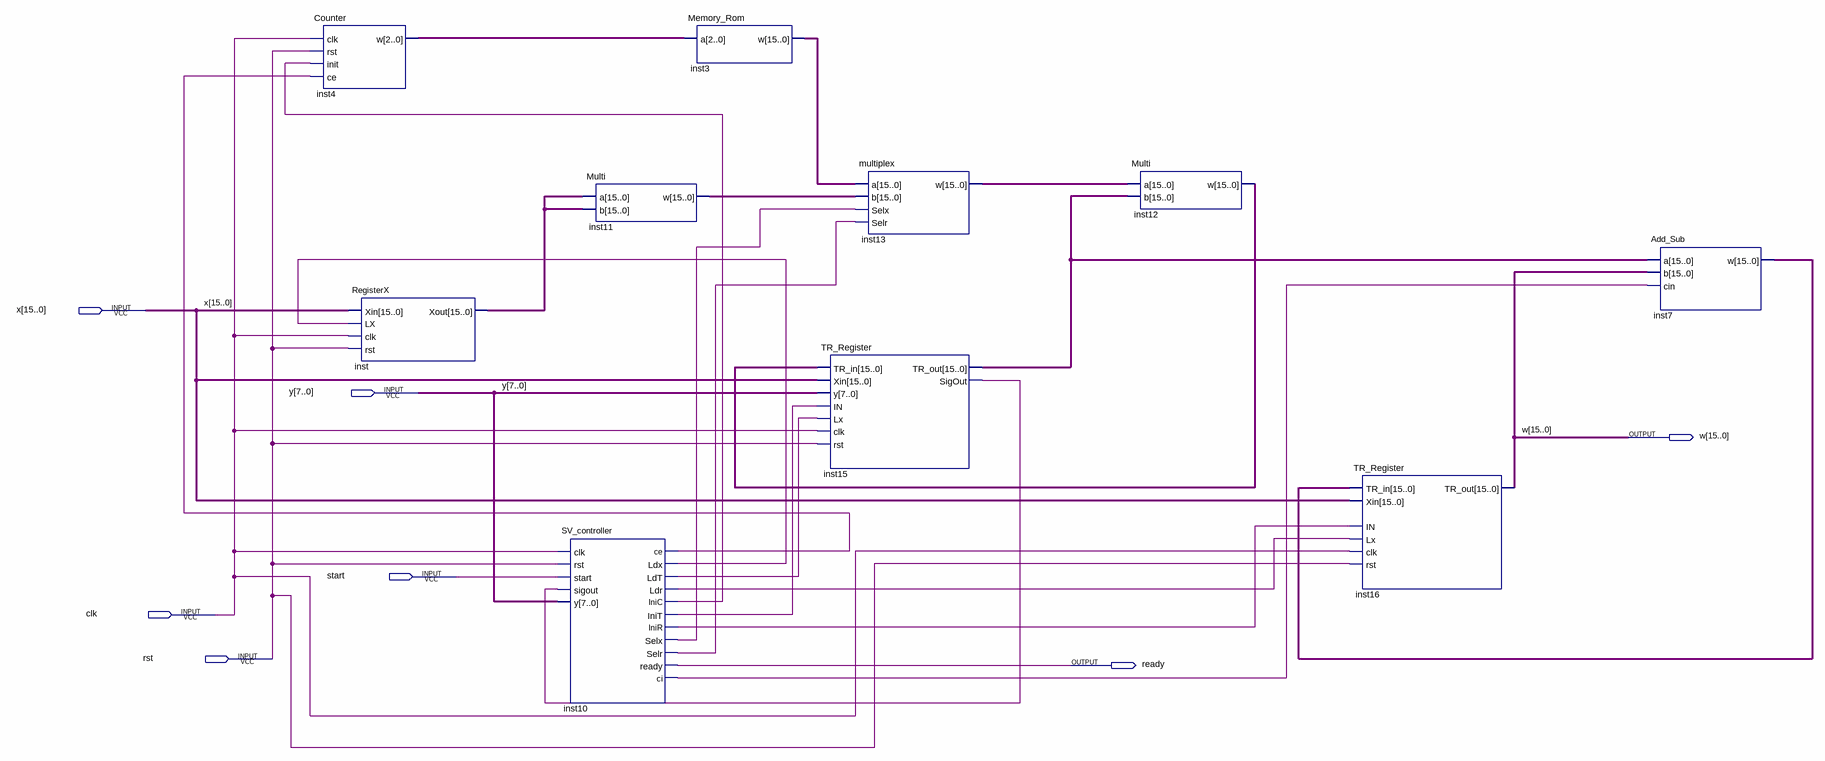
[diagram p0: schematic sheet]
// Quartus schematic sin.bdf as structural Verilog: 10 symbols, 7 pins
module sin (
  input  [15:0] x,
  input  [7:0] y,
  input  start,
  input  clk,
  input  rst,
  output [15:0] w,
  output ready
);

  wire inst10_ce, inst10_ci, inst10_inic, inst10_inir, inst10_init, inst10_ldr, inst10_ldt, inst10_ldx,
       inst10_selr, inst10_selx, inst15_sigout;
  wire [2:0] inst4_w;
  wire [15:0] inst3_w, inst7_w, inst11_w, inst12_w, inst13_w, inst15_tr_out, inst_xout;

  Counter inst4 (.clk(clk), .rst(rst), .init(inst10_inic), .ce(inst10_ce), .w(inst4_w));
  RegisterX inst (.Xin(x), .LX(inst10_ldx), .clk(clk), .rst(rst), .Xout(inst_xout));
  SV_controller inst10 (
    .clk(clk), .rst(rst), .start(start), .sigout(inst15_sigout), .y(y), .ce(inst10_ce), .Ldx(inst10_ldx),
    .LdT(inst10_ldt), .Ldr(inst10_ldr), .IniC(inst10_inic), .IniT(inst10_init), .IniR(inst10_inir),
    .Selx(inst10_selx), .Selr(inst10_selr), .ready(ready), .ci(inst10_ci));
  Multi inst11 (.a(inst_xout), .b(inst_xout), .w(inst11_w));
  Memory_Rom inst3 (.a(inst4_w), .w(inst3_w));
  TR_Register inst15 (
    .TR_in(inst12_w), .Xin(x), .y(y), .IN(inst10_init), .Lx(inst10_ldt), .clk(clk), .rst(rst),
    .TR_out(inst15_tr_out), .SigOut(inst15_sigout));
  multiplex inst13 (.Selr(inst10_selr), .Selx(inst10_selx), .a(inst3_w), .b(inst11_w), .w(inst13_w));
  Multi inst12 (.a(inst13_w), .b(inst15_tr_out), .w(inst12_w));
  TR_Register inst16 (.TR_in(inst7_w), .Xin(x), .IN(inst10_inir), .Lx(inst10_ldr), .clk(clk), .rst(rst), .TR_out(w));
  Add_Sub inst7 (.a(inst15_tr_out), .b(w), .cin(inst10_ci), .w(inst7_w));
endmodule
